# EAGLE design Microcontroller-Damien-original (EAGLE 5.06)
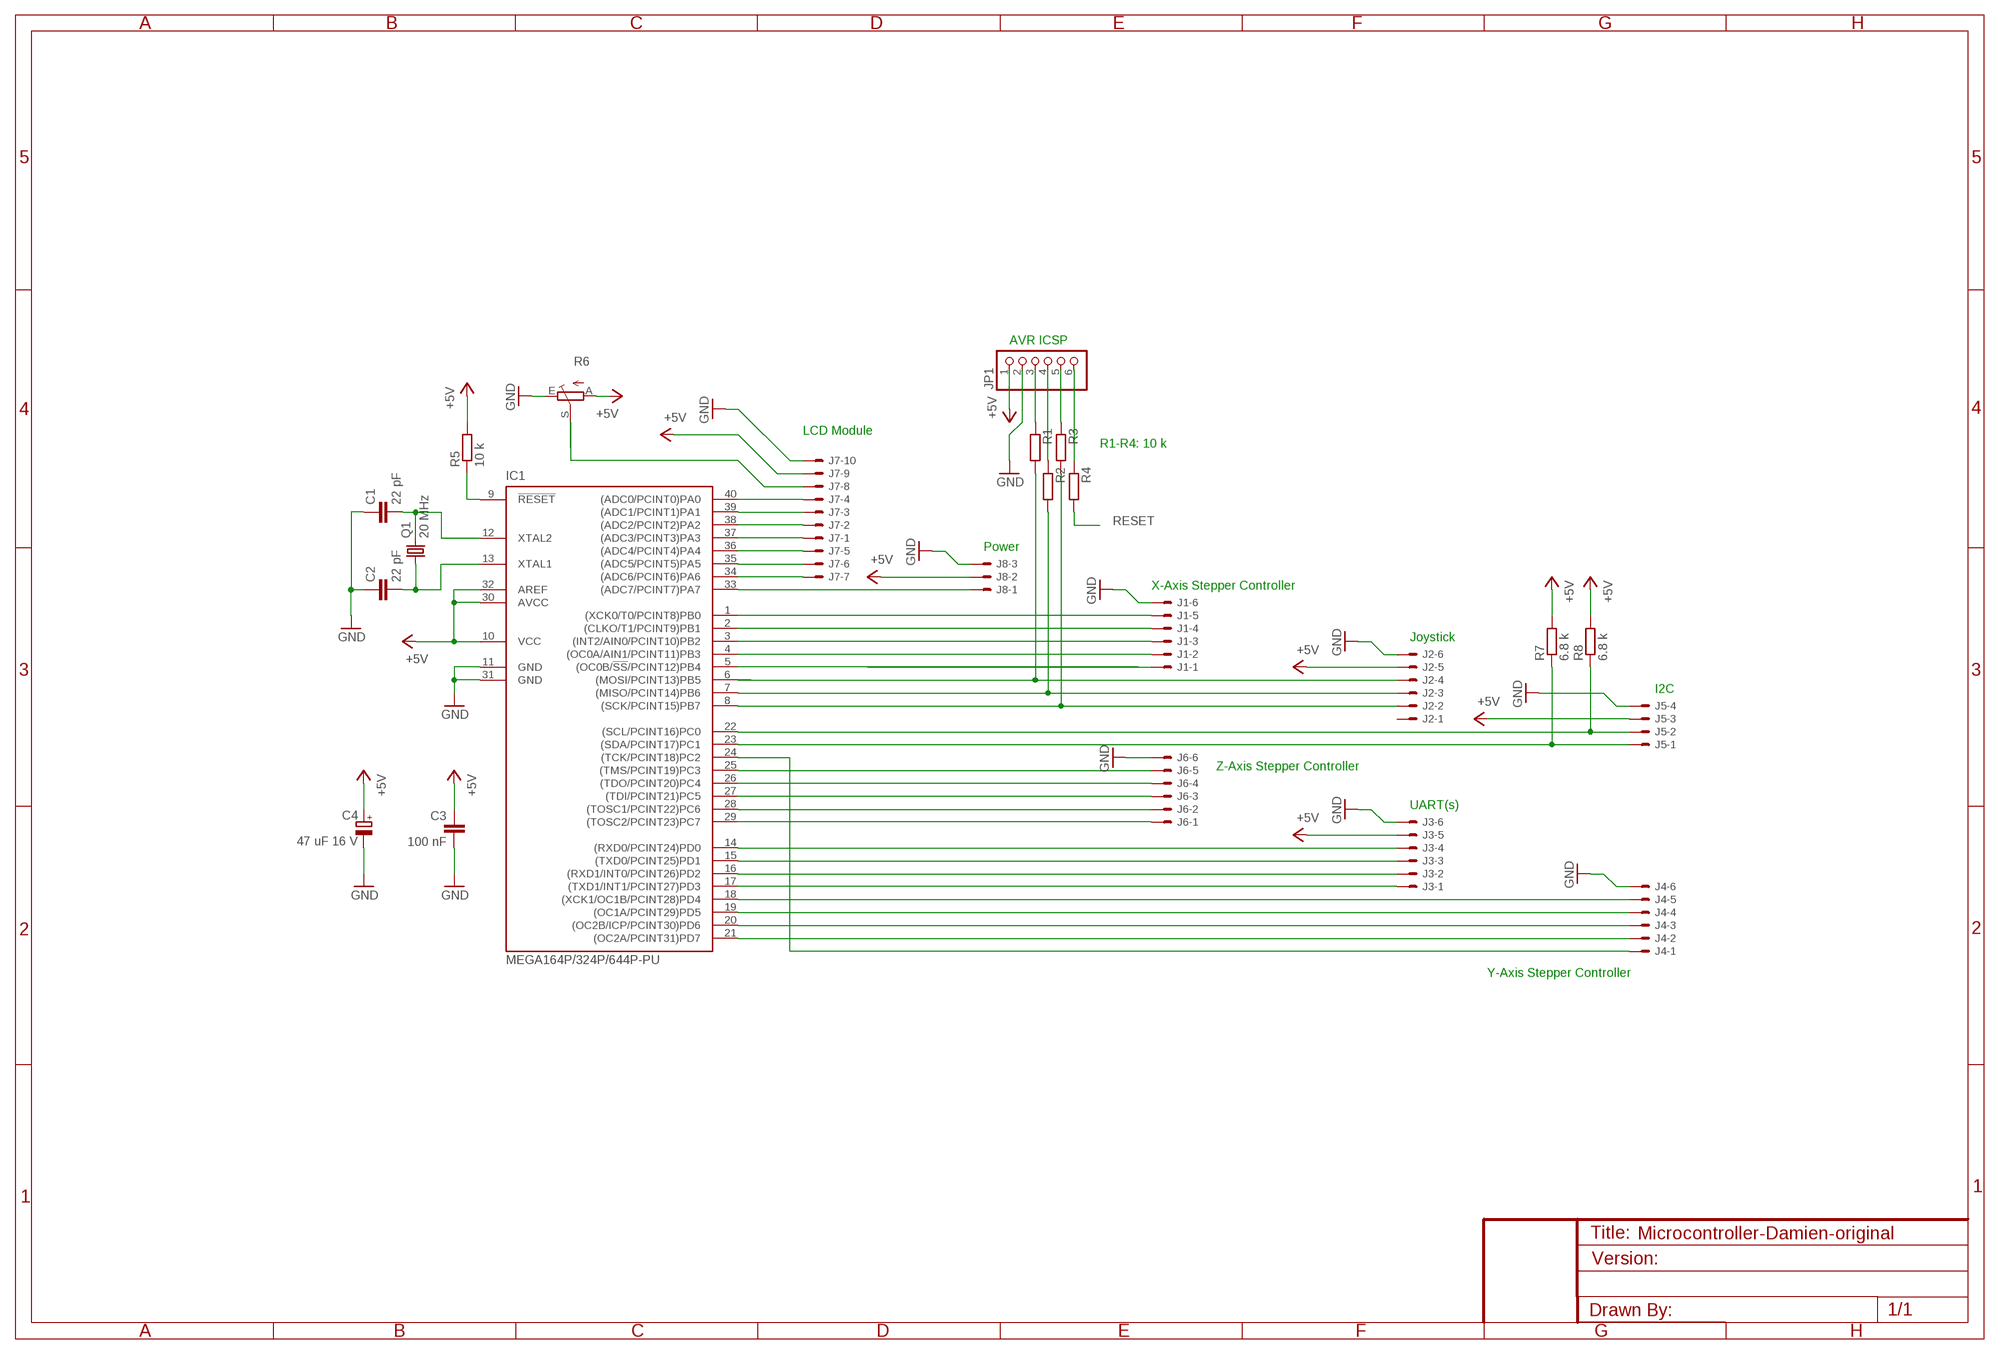
[diagram p0: schematic, sheet 1]

## Parts
C1  22 pF  C-EU050-024X044  [C050-024X044]
C2  22 pF  C-EU050-024X044  [C050-024X044]
C3  100 nF  C-EU050-024X044  [C050-024X044]
C4  47 uF 16 V  CPOL-EUE2.5-7  [E2,5-7]
IC1  MEGA164P/324P/644P-PU  [DIL40]
J1  22-27-2061-06  [6410-06]
J2  22-27-2061-06  [6410-06]
J3  22-27-2061-06  [6410-06]
J4  22-27-2061-06  [6410-06]
J5  22-27-2041-04  [6410-04]
J6  22-27-2061-06  [6410-06]
J7  22-27-2101-10  [6410-10]
J8  22-27-2031-03  [6410-03]
JP1  PINHD-1X6  [1X06]
Q1  20 MHz  CRYSTALHC49U-V  [HC49U-V]
R1  R-EU_0207/2V  [0207/2V]
R2  R-EU_0207/2V  [0207/2V]
R3  R-EU_0207/2V  [0207/2V]
R4  R-EU_0207/2V  [0207/2V]
R5  10 k  R-EU_0207/10  [0207/10]
R6  TRIM_EU-PT10S  [PT-10S]
R7  6.8 k  R-EU_0207/10  [0207/10]
R8  6.8 k  R-EU_0207/10  [0207/10]

## Nets
+5V: C3.1 C4.+ IC1.10(VCC) IC1.30(AVCC) IC1.32(AREF) J2.5 J3.5 J5.3 J7.9 J8.2 JP1.1 R5.2 R6.A R7.2 R8.2
GND: C1.1 C2.1 C3.2 C4.- IC1.11(GND) IC1.31(GND) J1.6 J2.6 J3.6 J4.6 J5.4 J6.6 J7.10 J8.3 JP1.2 R6.E
N$1: C1.2 IC1.12(XTAL2) Q1.2
N$2: C2.2 IC1.13(XTAL1) Q1.1
N$3: IC1.25((TMS/PCINT19)PC3) J6.5
N$4: IC1.1((XCK0/T0/PCINT8)PB0) J1.5
N$5: IC1.22((SCL/PCINT16)PC0) J5.2 R8.1
N$6: IC1.23((SDA/PCINT17)PC1) J5.1 R7.1
N$7: J7.8 R6.S
N$8: IC1.2((CLKO/T1/PCINT9)PB1) J1.4
N$9: IC1.3((INT2/AIN0/PCINT10)PB2) J1.3
N$10: IC1.4((OC0A/AIN1/PCINT11)PB3) J1.2
N$11: IC1.5((OC0B/!SS!/PCINT12)PB4) J1.1
N$12: IC1.8((SCK/PCINT15)PB7) J2.2 R3.2
N$13: IC1.7((MISO/PCINT14)PB6) J2.3 R2.2
N$14: IC1.6((MOSI/PCINT13)PB5) J2.4 R1.2
N$15: IC1.17((TXD1/INT1/PCINT27)PD3) J3.1
N$16: IC1.16((RXD1/INT0/PCINT26)PD2) J3.2
N$17: IC1.15((TXD0/PCINT25)PD1) J3.3
N$18: IC1.14((RXD0/PCINT24)PD0) J3.4
N$19: IC1.24((TCK/PCINT18)PC2) J4.1
N$20: IC1.18((XCK1/OC1B/PCINT28)PD4) J4.5
N$21: IC1.19((OC1A/PCINT29)PD5) J4.4
N$22: IC1.20((OC2B/ICP/PCINT30)PD6) J4.3
N$23: IC1.21((OC2A/PCINT31)PD7) J4.2
N$24: IC1.29((TOSC2/PCINT23)PC7) J6.1
N$25: IC1.28((TOSC1/PCINT22)PC6) J6.2
N$26: IC1.27((TDI/PCINT21)PC5) J6.3
N$27: IC1.26((TDO/PCINT20)PC4) J6.4
N$28: IC1.34((ADC6/PCINT6)PA6) J7.7
N$29: IC1.35((ADC5/PCINT5)PA5) J7.6
N$30: IC1.36((ADC4/PCINT4)PA4) J7.5
N$31: IC1.40((ADC0/PCINT0)PA0) J7.4
N$32: IC1.39((ADC1/PCINT1)PA1) J7.3
N$33: IC1.38((ADC2/PCINT2)PA2) J7.2
N$34: IC1.37((ADC3/PCINT3)PA3) J7.1
N$35: IC1.33((ADC7/PCINT7)PA7) J8.1
N$36: JP1.6 R4.1
N$38: JP1.5 R3.1
N$39: JP1.4 R2.1
N$40: JP1.3 R1.1
RESET: IC1.9(!RESET) R4.2 R5.1
Unconnected: J2.1

## Notes on the sheet
- AVR ICSP
- LCD Module
- R1-R4: 10 k
- Power
- X-Axis Stepper Controller
- Joystick
- I2C
- Z-Axis Stepper Controller
- UART(s)
- Y-Axis Stepper Controller

## Library data of the parts
C1-C3 = rcl:C-EU: CAPACITOR, European symbol
C4 = rcl:CPOL-EU: POLARIZED CAPACITOR, European symbol
IC1 = avr-5:MEGA164P/324P/644P-PU
J1-J4 J6 = con-molex:22-?-06: CONNECTOR wire to board 2.54 mm (.1 inch) pitch header
J5 = con-molex:22-?-04: CONNECTOR wire to board 2.54 mm (.1 inch) pitch header
J7 = con-molex:22-?-10: CONNECTOR wire to board 2.54 mm (.1 inch) pitch header
J8 = con-molex:22-?-03: CONNECTOR wire to board 2.54 mm (.1 inch) pitch header
JP1 = pinhead:PINHD-1X6: PIN HEADER
Q1 = crystal:CRYSTAL: CRYSTAL
R1-R5 R7 R8 = rcl:R-EU_: RESISTOR, European symbol
R6 = pot:TRIM_EU-: POTENTIOMETER

## Board
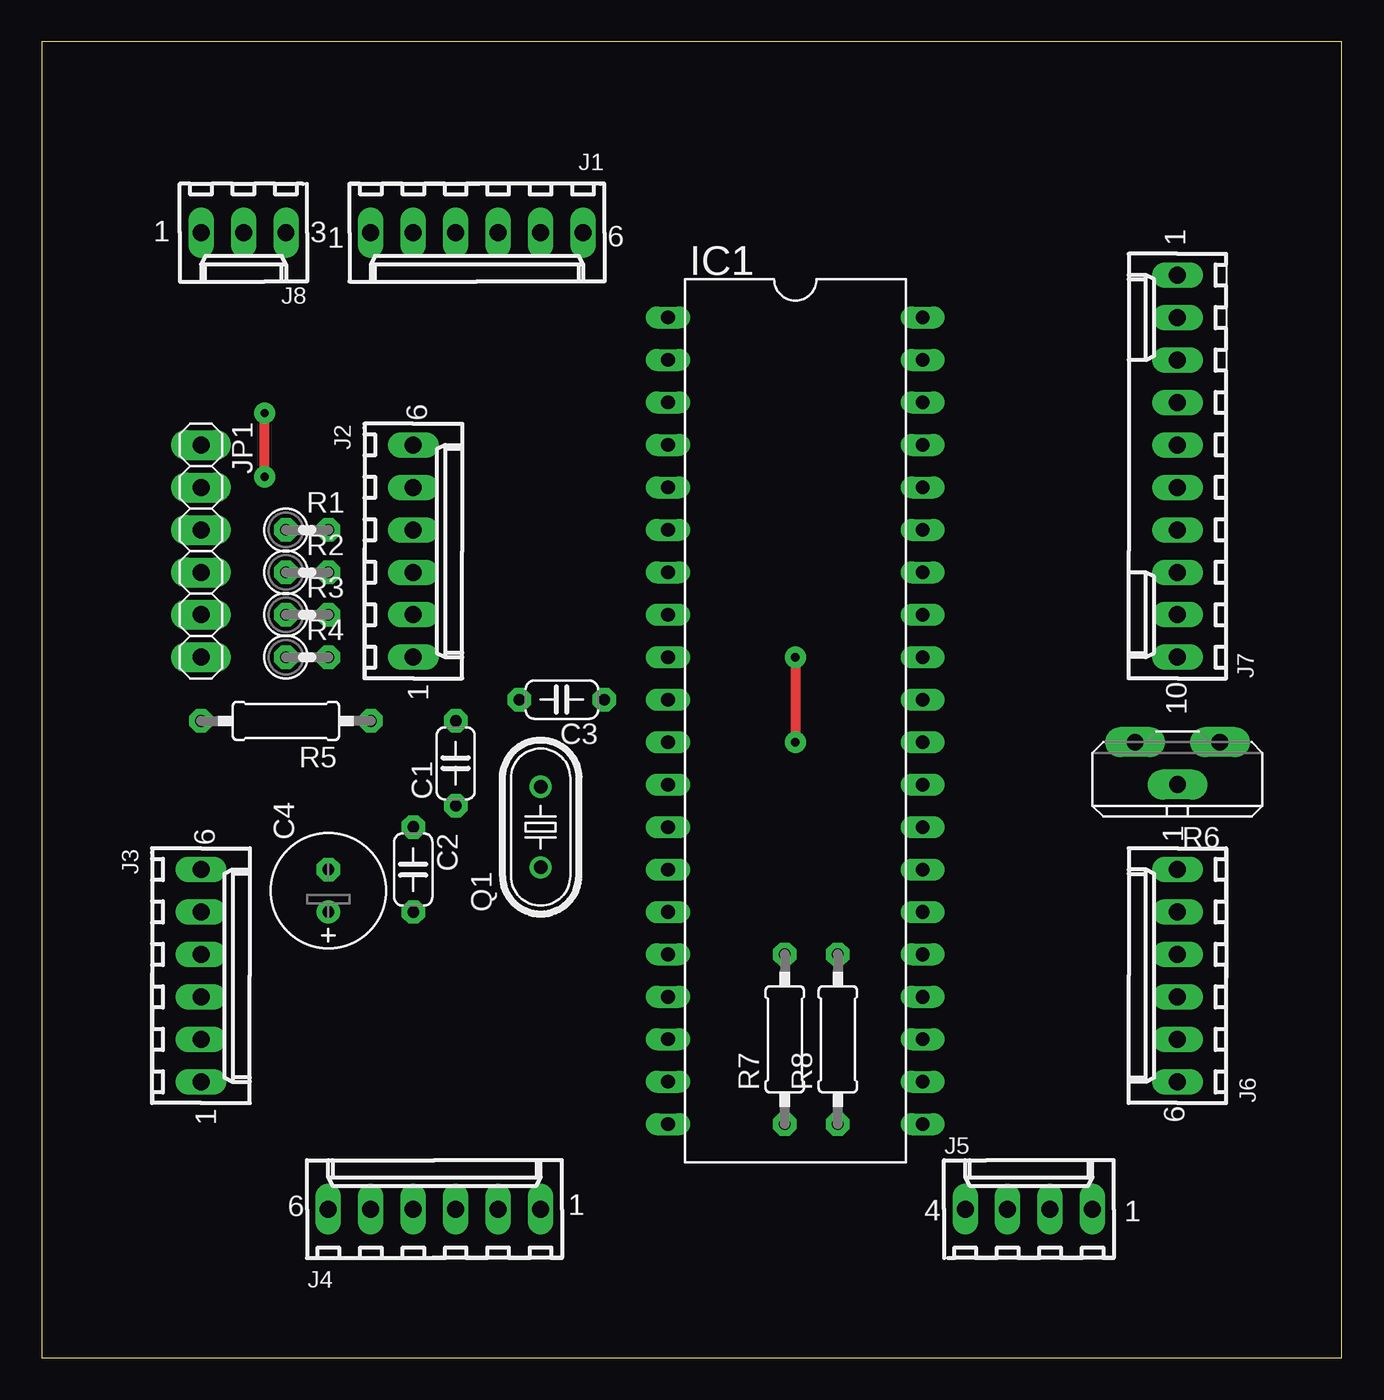
[diagram p1: board, top side]
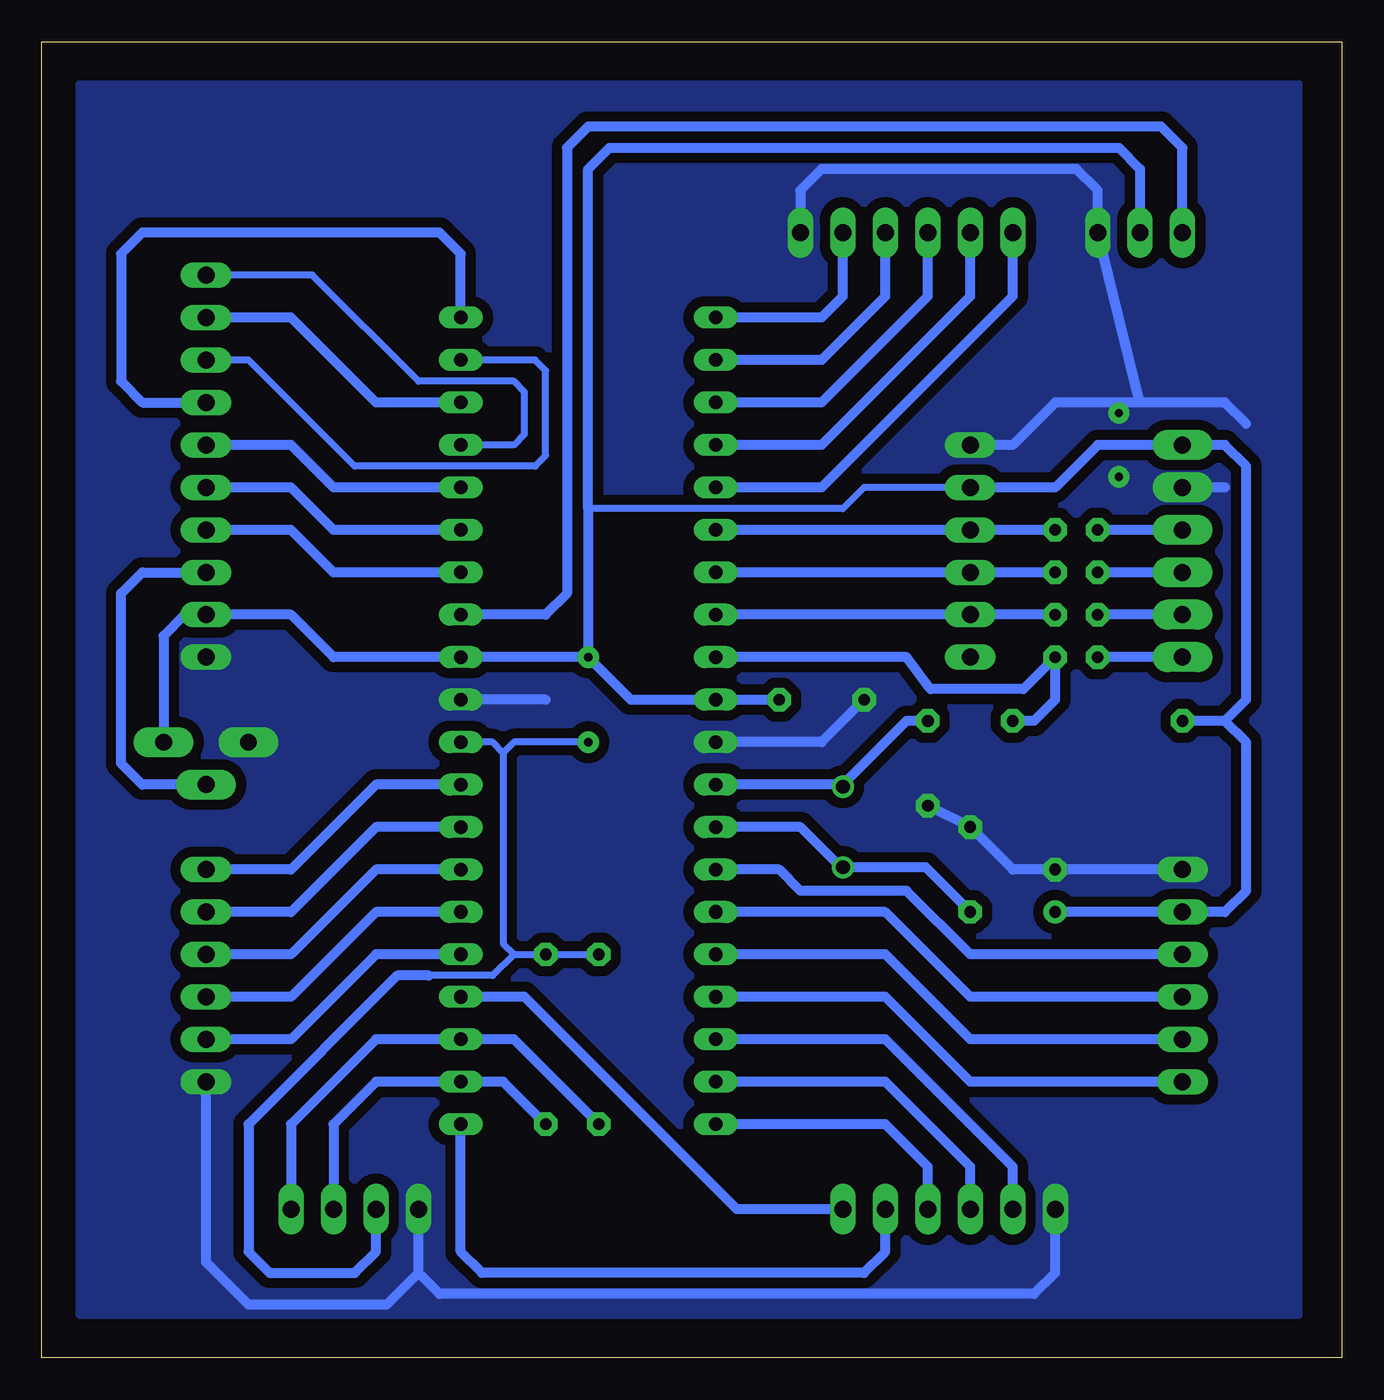
[diagram p2: board, bottom side, seen from below]

Size 77.77 x 78.73 mm. Coordinates in mm from the lower left corner, seen from the top.
Outline: 0,0 77.77,0 77.77,78.73 0,78.73 0,0
Copper layers (1*16): Top 0.035mm / dielectric 1.5mm / Bottom 0.035mm
Design rules "default": minimum track width 10mil, minimum drill 24mil, track to track 8mil, track to pad 8mil, pad to pad 8mil, via to via 8mil, smd to smd 8mil, copper to edge 40mil, drill to drill 8mil, minimum pad ring 10mil, minimum via ring 8mil, stop-mask expansion 4mil, vias tented up to drill 0mil, thermal gap 10mil

### Footprints (pad centres in the part's own frame; a part is rotated, then mirrored left to right if it is on the bottom)
C050-024X044 = drill 0.7 pad 1.4 octagon: 1 -2.54,0; 2 2.54,0
E2,5-7 = drill 0.7 pad 1.4 round: + -1.27,0 | drill 0.7 pad 1.4 octagon: - 1.27,0
DIL40 = drill 0.813 long: 1 -24.13,-7.62; 2 -21.59,-7.62; 3 -19.05,-7.62; 4 -16.51,-7.62; 5 -13.97,-7.62; 6 -11.43,-7.62; 7 -8.89,-7.62; 8 -6.35,-7.62; 9 -3.81,-7.62; 10 -1.27,-7.62; 11 1.27,-7.62; 12 3.81,-7.62; 13 6.35,-7.62; 14 8.89,-7.62; 15 11.43,-7.62; 16 13.97,-7.62; 17 16.51,-7.62; 18 19.05,-7.62; 19 21.59,-7.62; 20 24.13,-7.62; 21 24.13,7.62; 22 21.59,7.62; 23 19.05,7.62; 24 16.51,7.62; 25 13.97,7.62; 26 11.43,7.62; 27 8.89,7.62; 28 6.35,7.62; 29 3.81,7.62; 30 1.27,7.62; 31 -1.27,7.62; 32 -3.81,7.62; 33 -6.35,7.62; 34 -8.89,7.62; 35 -11.43,7.62; 36 -13.97,7.62; 37 -16.51,7.62; 38 -19.05,7.62; 39 -21.59,7.62; 40 -24.13,7.62
6410-06 = drill 1.016 long: 1 6.35,0; 2 3.81,0; 3 1.27,0; 4 -1.27,0; 5 -3.81,0; 6 -6.35,0
6410-04 = drill 1.016 long: 1 3.81,0; 2 1.27,0; 3 -1.27,0; 4 -3.81,0
6410-10 = drill 1.016 long: 1 11.43,0; 2 8.89,0; 3 6.35,0; 4 3.81,0; 5 1.27,0; 6 -1.27,0; 7 -3.81,0; 8 -6.35,0; 9 -8.89,0; 10 -11.43,0
6410-03 = drill 1.016 long: 1 2.54,0; 2 0,0; 3 -2.54,0
1X06 = drill 1.016 pad 1.8 long: 1 -6.35,0; 2 -3.81,0; 3 -1.27,0; 4 1.27,0; 5 3.81,0; 6 6.35,0
HC49U-V = drill 0.813 round: 1 -2.413,0; 2 2.413,0
0207/2V = drill 0.7 pad 1.4 octagon: 1 -1.27,0; 2 1.27,0
0207/10 = drill 0.7 pad 1.4 octagon: 1 -5.08,0; 2 5.08,0
PT-10S = drill 1 pad 1.8 long: A -2.54,-1.27; E 2.54,-1.27; S 0,1.27

### Placement (x,y rotation side)
C1  24.76,35.56 90 top
C2  22.22,29.21 270 top
C3  31.11,39.37 180 top
C4  17.14,27.94 90 top
IC1  45.09,38.1 270 top
J1  26.04,67.31 180 top
J2  22.22,48.26 270 top
J3  9.53,22.86 270 top
J4  23.49,8.89 0 top
J5  59.05,8.89 0 top
J6  67.94,22.86 90 top
J7  67.94,53.34 90 top
J8  12.06,67.31 180 top
JP1  9.53,48.26 270 top
Q1  29.84,31.75 90 top
R1  15.88,49.53 0 top
R2  15.88,46.99 0 top
R3  15.88,44.45 0 top
R4  15.88,41.91 0 top
R5  14.61,38.1 180 top
R6  67.94,35.56 180 top
R7  44.45,19.05 90 top
R8  47.62,19.05 90 top

### Tracks (layer width: path | path; a pad name or v marks a point on that pad's centre or on a via)
+5V  (via drill 0.5 pad 1.27)
  Top 0.61: v45.09,41.91 v45.09,36.83
  Bottom 0.406: J2.5 28.57,52.07 29.84,50.8 45.09,50.8 | v45.09,41.91 45.09,49.53 | 54.61,22.86 50.8,22.86 49.53,24.13 | IC1.30 50.8,36.83 50.16,36.2 | v45.09,36.83 49.53,36.83 50.16,36.2 | R7.2 R8.2 49.53,24.13 | 49.53,24.13 50.16,24.77 50.16,36.2
  Bottom 0.61: J5.3 57.79,6.35 59.05,5.08 64.13,5.08 65.41,6.35 65.41,13.97 56.52,22.86 54.61,22.86 | J2.5 17.14,52.07 14.61,54.61 JP1.1 6.99,54.61 5.71,53.34 5.71,39.37 6.99,38.1 | 6.99,38.1 5.71,36.83 5.71,27.94 6.99,26.67 J3.5 C4.+ | C3.1 IC1.10 42.55,39.37 v45.09,41.91 | J8.2 12.06,71.12 13.34,72.39 43.82,72.39 45.09,71.12 45.09,50.8 v45.09,41.91 | R6.A 70.48,43.18 69.21,44.45 J7.9 62.87,44.45 60.33,41.91 IC1.32 v45.09,41.91 | 6.99,38.1 R5.2
GND  (via drill 0.5 pad 1.27)
  Top 0.61: v13.34,52.7 v13.34,56.52
  Bottom 0.61: J4.6 17.14,5.08 18.41,3.81 53.98,3.81 55.25,5.08 | 55.25,5.08 J5.4 | 55.25,5.08 57.15,3.18 65.41,3.18 67.94,5.71 J6.6 | 47.62,39.37 IC1.31 | J1.6 32.39,69.85 31.11,71.12 15.88,71.12 14.61,69.85 J8.3 12.06,57.15 | C1.1 C2.1 19.68,29.21 C4.- J3.6 | IC1.11 31.11,36.83 C3.2 | J2.6 19.68,54.61 17.14,57.15 12.06,57.15 | 12.06,57.15 6.99,57.15 5.71,55.88 | 6.99,52.07 JP1.2
  pour Bottom (isolate 0.61, no thermals): 2.54,76.2 75.56,76.2 75.56,2.54 2.54,2.54
N$1
  Bottom 0.61: 29.84,34.29 IC1.12 | 29.84,34.29 26.04,38.1 C1.2 | 29.84,34.29 Q1.2
N$2
  Bottom 0.61: IC1.13 32.39,31.75 29.84,29.21 Q1.1 24.89,29.34 C2.2
N$3
  Bottom 0.61: IC1.25 57.79,24.13 62.87,19.05 J6.5
N$4
  Bottom 0.61: J1.5 29.84,63.5 31.11,62.23 IC1.1
N$5
  Bottom 0.61: J5.2 60.33,13.97 57.79,16.51 IC1.22 50.16,16.51 R8.1
N$6
  Bottom 0.61: J5.1 62.87,13.97 57.79,19.05 IC1.23 49.53,19.05 R7.1
N$7
  Bottom 0.61: R6.S 71.75,34.29 73.02,35.56 73.02,45.72 71.75,46.99 J7.8
N$8
  Bottom 0.61: IC1.2 31.11,59.69 27.3,63.5 J1.4
N$9
  Bottom 0.61: IC1.3 31.11,57.15 24.76,63.5 J1.3
N$10
  Bottom 0.61: IC1.4 31.11,54.61 22.22,63.5 J1.2
N$11
  Bottom 0.61: J1.1 19.68,63.5 31.11,52.07 IC1.5
N$12
  Bottom 0.61: R3.2 J2.2 IC1.8
N$13
  Bottom 0.61: IC1.7 J2.3 R2.2
N$14
  Bottom 0.61: IC1.6 J2.4 R1.2
N$15
  Bottom 0.61: J3.1 22.22,16.51 27.3,21.59 IC1.17
N$16
  Bottom 0.61: IC1.16 27.3,24.13 22.22,19.05 J3.2
N$17
  Bottom 0.61: IC1.15 27.3,26.67 22.22,21.59 J3.3
N$18
  Bottom 0.61: IC1.14 33.66,29.21 32.39,27.94 26.04,27.94 22.22,24.13 J3.4
N$19
  Bottom 0.61: J4.1 36.2,8.89 48.9,21.59 IC1.24
N$20
  Bottom 0.61: J4.5 19.68,11.43 27.3,19.05 IC1.18
N$21
  Bottom 0.61: IC1.19 27.3,16.51 22.22,11.43 J4.4
N$22
  Bottom 0.61: J4.3 24.76,11.43 27.3,13.97 IC1.20
N$23
  Bottom 0.61: J4.2 27.3,6.35 28.57,5.08 51.44,5.08 52.71,6.35 IC1.21
N$24
  Bottom 0.61: IC1.29 57.79,34.29 62.87,29.21 J6.1
N$25
  Bottom 0.61: IC1.28 57.79,31.75 62.87,26.67 J6.2
N$26
  Bottom 0.61: IC1.27 57.79,29.21 62.87,24.13 J6.3
N$27
  Bottom 0.61: IC1.26 57.79,26.67 62.87,21.59 J6.4
N$28
  Bottom 0.61: IC1.34 60.33,46.99 62.87,49.53 J7.7
N$29
  Bottom 0.61: IC1.35 60.33,49.53 62.87,52.07 J7.6
N$30
  Bottom 0.61: IC1.36 60.33,52.07 62.87,54.61 J7.5
N$31
  Bottom 0.61: J7.4 71.75,57.15 73.02,58.42 73.02,66.04 71.75,67.31 53.98,67.31 52.71,66.04 IC1.40
N$32
  Bottom 0.406: J7.3 65.41,59.69 59.05,53.34 48.26,53.34 47.62,53.98 47.62,59.05 48.26,59.69 IC1.39
N$33
  Bottom 0.61: IC1.38 57.79,57.15 62.87,62.23 J7.2
N$34
  Bottom 0.406: J7.1 61.59,64.77 55.25,58.42 49.53,58.42 48.9,57.79 48.9,55.24 49.53,54.61 IC1.37
N$35
  Bottom 0.61: J8.1 9.53,72.39 10.79,73.66 45.09,73.66 46.36,72.39 46.36,45.72 47.62,44.45 IC1.33
N$36
  Bottom 0.61: JP1.6 R4.1
N$38
  Bottom 0.61: JP1.5 R3.1
N$39
  Bottom 0.61: JP1.4 R2.1
N$40
  Bottom 0.61: JP1.3 R1.1
RESET
  Bottom 0.61: IC1.9 26.04,41.91 24.66,40.08 24.59,40 19.05,40 R4.2 17.14,39.37 18.41,38.1 R5.1